# Altium schematic sheet RS485 Tranciever.SchDoc: RS485 Tranciever
size A4; ApprovedBy: LD Stanton; Author: LD Stanton; CompanyName: University of Cape Town; DrawnBy: Lawrence Stanton; Engineer: Lawrence Stanton; Organization: University of Cape Town; Address1: Department of Electrical Engineering; Address2: Rondebosch; Address3: Cape Town; Address4: South Africa 7701; DocumentNumber: 14; SheetNumber: 14; SheetTotal: 20
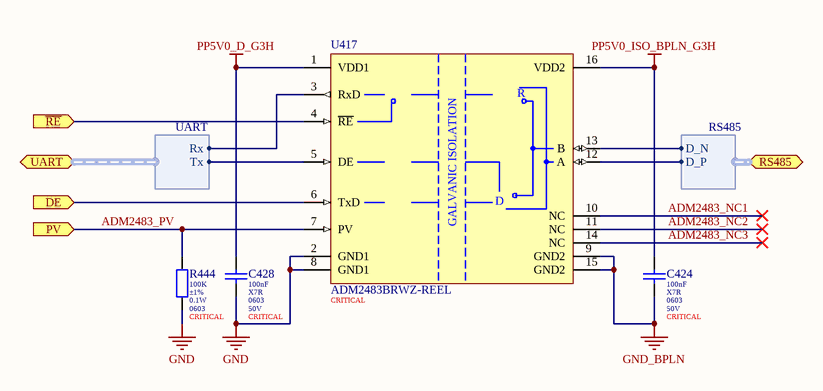
[diagram p0: RS485 Tranciever.SchDoc]

## Parts
C424  value 100nF  Dielectric: X7R  Package: 0603  Voltage: 50V  Populate: CRITICAL  [0603 (Yageo DA) B]  (hidden comment: CC0603KRX7R9BB104)
C428  value 100nF  Dielectric: X7R  Package: 0603  Voltage: 50V  Populate: CRITICAL  [0603 (Yageo DA) B]  (hidden comment: CC0603KRX7R9BB104)
R444  value 100K  Tolerance: ±1%  Power: 0.1W  Package: 0603  Populate: CRITICAL  [0603 (Uniroyal) B]  (hidden comment: 0603WAF1003T5E)
U417  ADM2483BRWZ-REEL  Placement: CRITICAL  [SOIC-16 (ADM2483) B]

## Ports
DE (in), PV (in), RS485 (bidir, harness RS485), UART (bidir, harness UART), ~{RE} (in)

## Harnesses
RS485: D_N, D_P
UART: Rx, Tx

## Nets
GND: C428.2 R444.2 U417.2(GND1) U417.8(GND1)
GND_BPLN: C424.2 U417.9(GND2) U417.15(GND2)
PP5V0_D_G3H: C428.1 U417.1(VDD1)
PP5V0_ISO_BPLN_G3H: C424.1 U417.16(VDD2)
~{RE}: U417.4(~{RE}) ; port ~{RE}
ADM2483_NC1: U417.10(NC)
ADM2483_NC2: U417.11(NC)
ADM2483_NC3: U417.14(NC)
ADM2483_PV: R444.1 U417.7(PV) ; port PV
DE: U417.6(TxD) ; port DE
NetU417_3: U417.3(RxD) ; port UART.Rx
NetU417_5: U417.5(DE) ; port UART.Tx
NetU417_12: U417.12(A) ; port RS485.D_P
NetU417_13: U417.13(B) ; port RS485.D_N

## Notes on the sheet
- Size:
- Date:
- A4
- Number:
- Time:
- Revision:
- Sheet
- of
- File:
- Author:
- (in symbol CMP-015-00000-6) R; GALVANIC ISOLATION; D

## Library data of the parts
C424 C428 = CMP-047-000000-7: MLCC 100nF 50V 0603 X7R ±10%; Manufacturer: Yageo; LCSC Part Number: C14663; Tolerance: ±10%; ComponentLink1URL: https://datasheet.lcsc.com/szlcsc/YAGEO-CC0603KRX7R9BB104_C14663.pdf; ComponentLink1Description: Datasheet
R444 = CMP-010-000288-10: Resistor 100K 0603 ±1% Thick Film Uniroyal; Working Voltage: 75V; Temperature Coefficient: ±100ppm/K; Manufacturer: Uniroyal; ComponentLink1URL: https://datasheet.lcsc.com/szlcsc/1811062009_UNI-ROYAL-Uniroyal-Elec-0603WAF1002T5E_C25804.pdf; LCSC Part Number: C25803; Temperature: -55 - 155°C; ComponentLink1Description: Datasheet; Pin Count: 2
U417 = CMP-015-00000-6: Single Transmitter/Receiver RS-485 16-Pin SOIC W T/R; Min Supply Voltage: 2.7V; Max Supply Voltage: 5.5V; Data Rate: 500Kbps; Operating Supply Voltage: 5V; Isolation Voltage: 2.5kV; Operating Supply Current: 2.5mA; LCSC Part Number: C9637; ComponentLink1URL: https://datasheet.lcsc.com/lcsc/1810181111_Analog-Devices-ADM2483BRWZ-REEL_C9637.pdf; Case/Package: SOIC; Max Operating Temperature: 85°C; RoHS Compliant: Yes; Min Operating Temperature: -40°C; ComponentLink1Description: Datasheet